# Altium schematic sheet Elekid_02.SchDoc
size A4
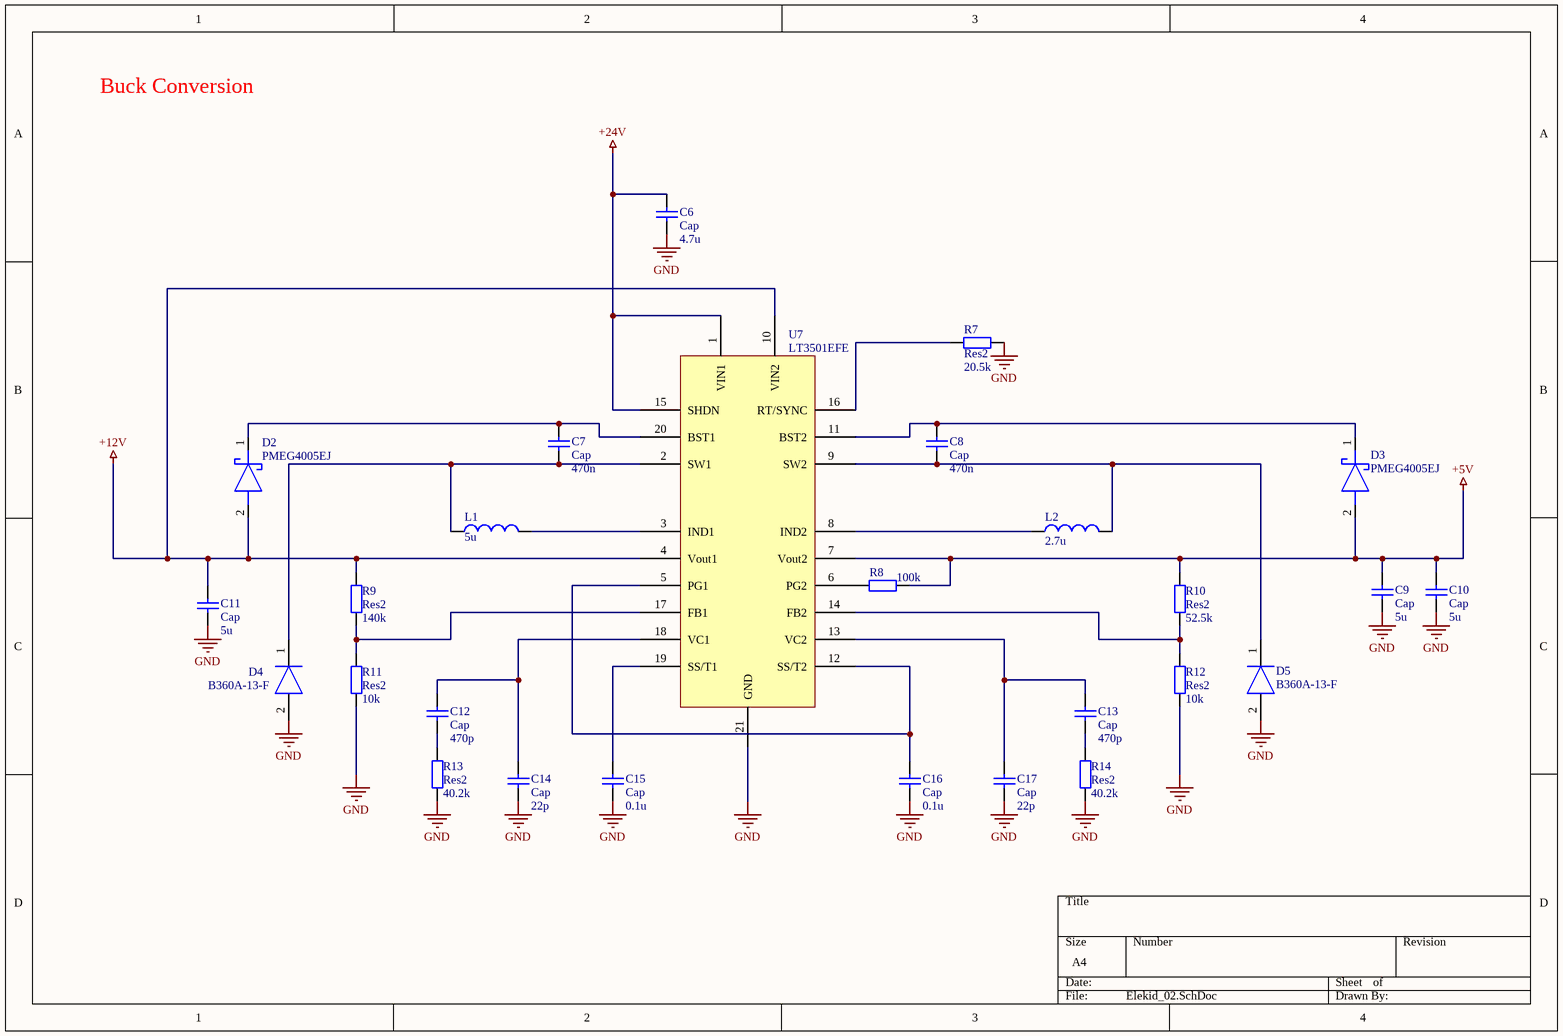
[diagram p0: Elekid_02.SchDoc]

## Parts
C6  Cap  value 4.7u  [C0805]
C7  Cap  value 470n  [C0805]
C8  Cap  value 470n  [C0805]
C9  Cap  value 5u  [C0805]
C10  Cap  value 5u  [C0805]
C11  Cap  value 5u  [C0805]
C12  Cap  value 470p  [C0805]
C13  Cap  value 470p  [C0805]
C14  Cap  value 22p  [C0805]
C15  Cap  value 0.1u  [C0805]
C16  Cap  value 0.1u  [C0805]
C17  Cap  value 22p  [C0805]
D2  PMEG4005EJ  [SOD2512X80N]
D3  PMEG4005EJ  [SOD2512X80N]
D4  B360A-13-F  [DIOM5226X240N]
D5  B360A-13-F  [DIOM5226X240N]
L1  value 5u  [c0805]  (hidden comment: Inductor)
L2  value 2.7u  [c0805]  (hidden comment: Inductor)
R7  Res2  value 20.5k  [C0805]
R8  value 100k  [C0805]  (hidden comment: Res2)
R9  Res2  value 140k  [C0805]
R10  Res2  value 52.5k  [C0805]
R11  Res2  value 10k  [C0805]
R12  Res2  value 10k  [C0805]
R13  Res2  value 40.2k  [C0805]
R14  Res2  value 40.2k  [C0805]
U7  LT3501EFE  [SOP65P640X120-21N]

## Nets
+5V: C9.2 C10.2 D3.2(A) R8.1 R10.2 U7.7(Vout2)
+12V: C11.2 D2.2(A) R9.2 U7.4(Vout1) U7.10(VIN2)
+24V: C6.2 U7.1(VIN1) U7.15(SHDN)
GND: C6.1 C9.1 C10.1 C11.1 C14.1 C15.1 C16.1 C17.1 D4.2(A) D5.2(A) R7.2 R11.1 R12.1 R13.1 R14.1 U7.21(GND)
NetC7_1: C7.1 D4.1(K) L1.1 U7.2(SW1)
NetC7_2: C7.2 D2.1(K) U7.20(BST1)
NetC8_1: C8.1 D5.1(K) L2.2 U7.9(SW2)
NetC8_2: C8.2 D3.1(K) U7.11(BST2)
NetC12_1: C12.1 R13.2
NetC12_2: C12.2 C14.2 U7.18(VC1)
NetC13_1: C13.1 R14.2
NetC13_2: C13.2 C17.2 U7.13(VC2)
NetC15_2: C15.2 U7.19(SS/T1)
NetC16_2: C16.2 U7.5(PG1) U7.12(SS/T2)
NetL1_2: L1.2 U7.3(IND1)
NetL2_1: L2.1 U7.8(IND2)
NetR7_1: R7.1 U7.16(RT/SYNC)
NetR8_2: R8.2 U7.6(PG2)
NetR9_1: R9.1 R11.2 U7.17(FB1)
NetR10_1: R10.1 R12.2 U7.14(FB2)

## Notes on the sheet
- Buck Conversion

## Library data of the parts
C6-C17 = Cap: Capacitor; Published: 8-Jun-2000; LatestRevisionDate: 17-Jul-2002; LatestRevisionNote: Re-released for DXP Platform.; PackageReference: RAD-0.3; Publisher: Altium Limited; PackageDescription: Radial Cap, Thru-Hole; 2 Leads; 0.3 in Pin Spacing
D2 D3 = PMEG4005EJ: Schottky Diode; Manufacturer_Name: Nexperia; Datasheet Link: http://www.nxp.com/documents/data_sheet/PMEGXX05EH_EJ_SER.pdf; Height: 0.8mm; Manufacturer_Part_Number: PMEG4005EJ; Arrow Part Number: PMEG4005EJ; Mouser Part Number: N/A; Mouser Price/Stock: https://www.mouser.com/Search/Refine.aspx?Keyword=N%2FA
D4 D5 = B360A-13-F: Diode; Manufacturer_Name: Diodes Inc.; Datasheet Link: https://www.diodes.com/assets/Datasheets/ds30891.pdf; Height: 2.4mm; Manufacturer_Part_Number: B360A-13-F; Arrow Part Number: B360A-13-F; Arrow Price/Stock: https://www.arrow.com/en/products/b360a-13-f/diodes-incorporated; Mouser Part Number: 621-B360A-F; Mouser Price/Stock: https://www.mouser.co.uk/ProductDetail/Diodes-Incorporated/B360A-13-F?qs=sVoUGXYOGv3xoCWNHVb4bA%3D%3D
L1 L2 = Inductor: Code_IEC: 1005; Published: 8-Jun-2000; LatestRevisionDate: 29-May-2009; LatestRevisionNote: IPC-7351 Footprint Added.; PackageReference: 0402-A; Publisher: Altium Limited; PackageDescription: Chip Inductor; Code_JEITA: 0402
R7-R14 = Res2: Resistor; Published: 8-Jun-2000; LatestRevisionDate: 17-Jul-2002; LatestRevisionNote: Re-released for DXP Platform.; PackageReference: AXIAL-0.4; Publisher: Altium Limited; PackageDescription: Axial Device, Thru-Hole; 2 Leads; 0.4 in Pin Spacing